# Altium schematic sheet 0093_M.2 KEY-E WLAN-BT.SchDoc
size A3
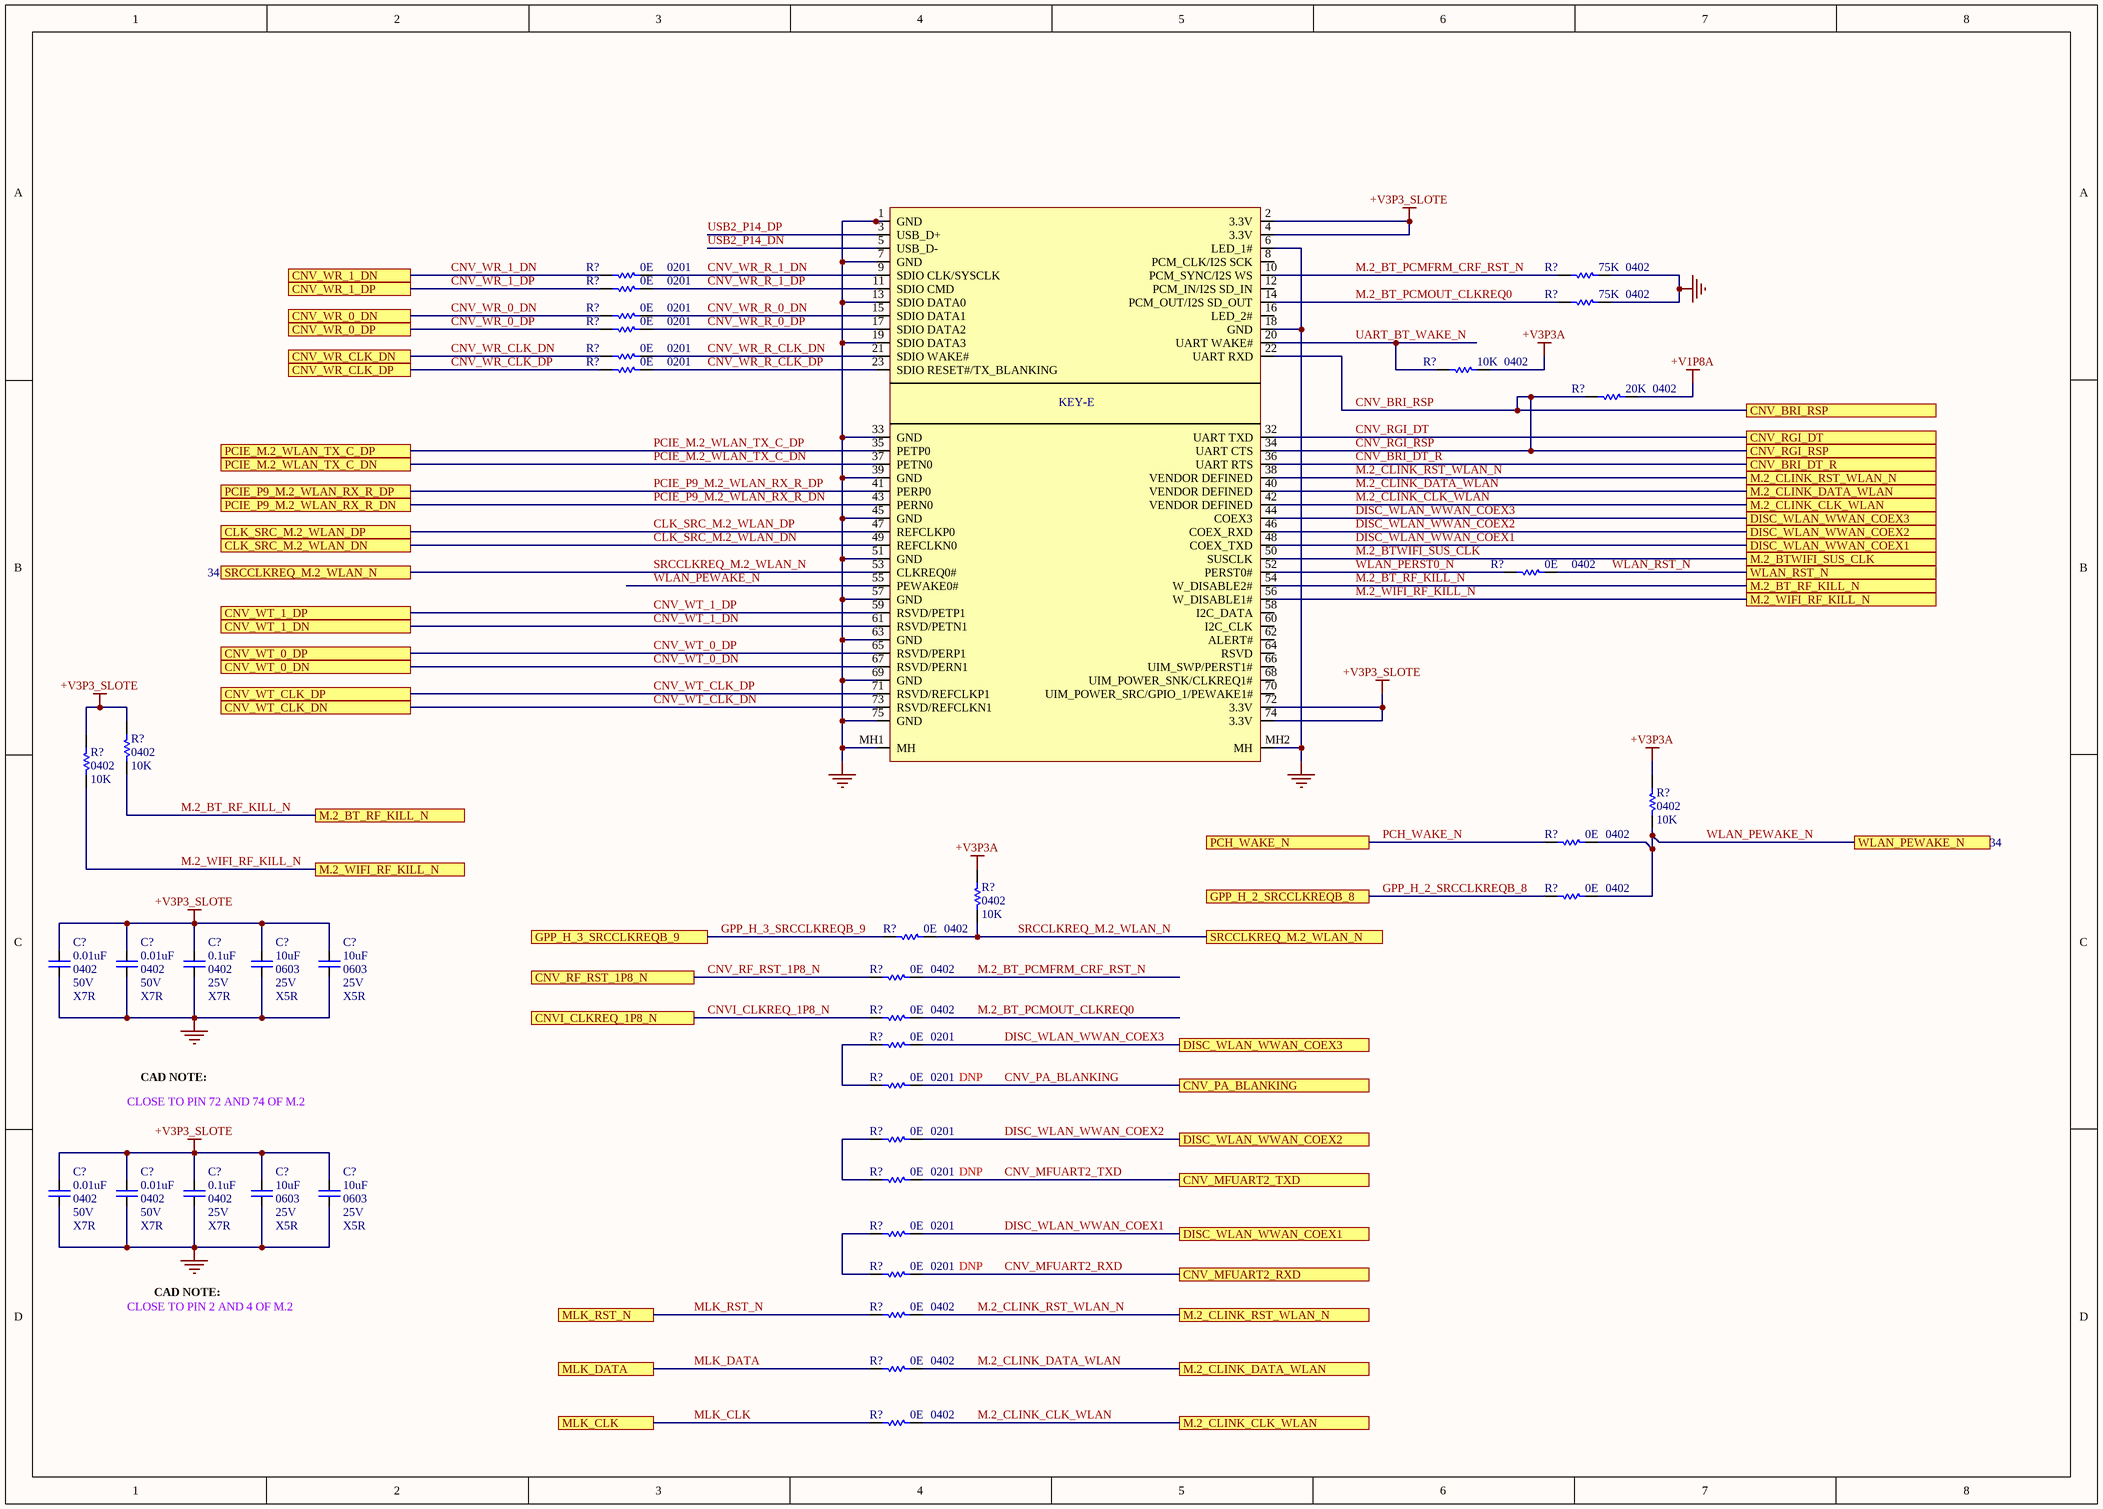
[diagram p0: 0093_M.2 KEY-E WLAN-BT.SchDoc]

## Parts
(Parts that share a designator on the sheet are numbered #1, #2 ... from top to bottom, then left to right.)
C?#1  value 0.01uF  Case/Package: 0402  Voltage: 50V  Dielectric: X7R  [CAPC0402]
C?#2  value 0.01uF  Case/Package: 0402  Voltage: 50V  Dielectric: X7R  [CAPC0402]
C?#3  value 0.1uF  Case/Package: 0402  Voltage: 25V  Dielectric: X7R  [CAPC0402]
C?#4  value 10uF  Case/Package: 0603  Voltage: 25V  Dielectric: X5R  [RESC0603]
C?#5  value 10uF  Case/Package: 0603  Voltage: 25V  Dielectric: X5R  [RESC0603]
C?#6  value 0.01uF  Case/Package: 0402  Voltage: 50V  Dielectric: X7R  [CAPC0402]
C?#7  value 0.01uF  Case/Package: 0402  Voltage: 50V  Dielectric: X7R  [CAPC0402]
C?#8  value 0.1uF  Case/Package: 0402  Voltage: 25V  Dielectric: X7R  [CAPC0402]
C?#9  value 10uF  Case/Package: 0603  Voltage: 25V  Dielectric: X5R  [RESC0603]
C?#10  value 10uF  Case/Package: 0603  Voltage: 25V  Dielectric: X5R  [RESC0603]
J?  C_M2_75P_KEYE_2EM  (value not drawn)
R?#1  value 0E  Case/Package: 0201  [RESC0201]  (hidden comment: Res)
R?#2  value 75K  Case/Package: 0402  [RESC0402]  (hidden comment: Res)
R?#3  value 0E  Case/Package: 0201  [RESC0201]  (hidden comment: Res)
R?#4  value 75K  Case/Package: 0402  [RESC0402]  (hidden comment: Res)
R?#5  value 0E  Case/Package: 0201  [RESC0201]  (hidden comment: Res)
R?#6  value 0E  Case/Package: 0201  [RESC0201]  (hidden comment: Res)
R?#7  value 0E  Case/Package: 0201  [RESC0201]  (hidden comment: Res)
R?#8  value 0E  Case/Package: 0201  [RESC0201]  (hidden comment: Res)
R?#9  value 10K  Case/Package: 0402  [RESC0402]  (hidden comment: Res)
R?#10  value 20K  Case/Package: 0402  [RESC0402]  (hidden comment: Res)
R?#11  value 0E  Case/Package: 0402  [RESC0402]  (hidden comment: Res)
R?#12  value 10K  Case/Package: 0402  [RESC0402]  (hidden comment: Res)
R?#13  value 10K  Case/Package: 0402  [RESC0402]  (hidden comment: Res)
R?#14  value 10K  Case/Package: 0402  [RESC0402]  (hidden comment: Res)
R?#15  value 0E  Case/Package: 0402  [RESC0402]  (hidden comment: Res)
R?#16  value 10K  Case/Package: 0402  [RESC0402]  (hidden comment: Res)
R?#17  value 0E  Case/Package: 0402  [RESC0402]  (hidden comment: Res)
R?#18  value 0E  Case/Package: 0402  [RESC0402]  (hidden comment: Res)
R?#19  value 0E  Case/Package: 0402  [RESC0402]  (hidden comment: Res)
R?#20  value 0E  Case/Package: 0402  [RESC0402]  (hidden comment: Res)
R?#21  value 0E  Case/Package: 0201  [RESC0201]  (hidden comment: Res)
R?#22  value 0E  Case/Package: 0201  [RESC0201]  (hidden comment: Res)
R?#23  value 0E  Case/Package: 0201  [RESC0201]  (hidden comment: Res)
R?#24  value 0E  Case/Package: 0201  [RESC0201]  (hidden comment: Res)
R?#25  value 0E  Case/Package: 0201  [RESC0201]  (hidden comment: Res)
R?#26  value 0E  Case/Package: 0201  [RESC0201]  (hidden comment: Res)
R?#27  value 0E  Case/Package: 0402  [RESC0402]  (hidden comment: Res)
R?#28  value 0E  Case/Package: 0402  [RESC0402]  (hidden comment: Res)
R?#29  value 0E  Case/Package: 0402  [RESC0402]  (hidden comment: Res)

## Ports
CLK_SRC_M.2_WLAN_DN, CLK_SRC_M.2_WLAN_DP, CNV_BRI_DT_R, CNV_BRI_RSP, CNV_MFUART2_RXD, CNV_MFUART2_TXD, CNV_PA_BLANKING, CNV_RF_RST_1P8_N, CNV_RGI_DT, CNV_RGI_RSP, CNV_WR_0_DN, CNV_WR_0_DP, CNV_WR_1_DN, CNV_WR_1_DP, CNV_WR_CLK_DN, CNV_WR_CLK_DP, CNV_WT_0_DN, CNV_WT_0_DP, CNV_WT_1_DN, CNV_WT_1_DP, CNV_WT_CLK_DN, CNV_WT_CLK_DP, CNVI_CLKREQ_1P8_N, DISC_WLAN_WWAN_COEX1, DISC_WLAN_WWAN_COEX2, DISC_WLAN_WWAN_COEX3, GPP_H_2_SRCCLKREQB_8, GPP_H_3_SRCCLKREQB_9, M.2_BT_RF_KILL_N, M.2_BTWIFI_SUS_CLK, M.2_CLINK_CLK_WLAN, M.2_CLINK_DATA_WLAN, M.2_CLINK_RST_WLAN_N, M.2_WIFI_RF_KILL_N, MLK_CLK, MLK_DATA, MLK_RST_N, PCH_WAKE_N, PCIE_M.2_WLAN_TX_C_DN, PCIE_M.2_WLAN_TX_C_DP, PCIE_P9_M.2_WLAN_RX_R_DN, PCIE_P9_M.2_WLAN_RX_R_DP, SRCCLKREQ_M.2_WLAN_N, WLAN_PEWAKE_N, WLAN_RST_N

## Nets
3P3V_2: J?.2(3P3V_2)
3P3V_4: J?.4(3P3V_4)
3P3V_72: J?.72(3P3V_72)
3P3V_74: J?.74(3P3V_74)
+V1P8A: R?#10.2
+V3P3_SLOTE: C?#1.2 C?#2.2 C?#3.2 C?#4.2 C?#5.2 C?#6.2 C?#7.2 C?#8.2 C?#9.2 C?#10.2 J?.2(3.3V) J?.4(3.3V) J?.72(3.3V) J?.74(3.3V) R?#12.2 R?#13.2
+V3P3A: R?#9.2 R?#14.2 R?#16.2
GND: C?#1.1 C?#2.1 C?#3.1 C?#4.1 C?#5.1 C?#6.1 C?#7.1 C?#8.1 C?#9.1 C?#10.1 J?.1(GND) J?.6(LED_1#) J?.7(GND) J?.13(SDIO_DATA0) J?.18(GND) J?.19(SDIO_DATA3) J?.33(GND) J?.39(GND) J?.45(GND) J?.51(GND) J?.57(GND) J?.63(GND) J?.69(GND) J?.75(GND) J?.MH1(MH) J?.MH2(MH) R?#2.2 R?#4.2
CLK_SRC_M.2_WLAN_DN: J?.49(REFCLKN0) ; port CLK_SRC_M.2_WLAN_DN
CLK_SRC_M.2_WLAN_DP: J?.47(REFCLKP0) ; port CLK_SRC_M.2_WLAN_DP
CNV_BRI_DT_R: J?.36(UART_RTS) ; port CNV_BRI_DT_R
CNV_BRI_RSP: J?.22(UART_RXD) J?.34(UART_CTS) R?#10.1 ; port CNV_BRI_RSP, port CNV_RGI_RSP  [also labelled CNV_RGI_RSP]
CNV_MFUART2_RXD: R?#26.1 ; port CNV_MFUART2_RXD
CNV_MFUART2_TXD: R?#24.1 ; port CNV_MFUART2_TXD
CNV_PA_BLANKING: R?#22.1 ; port CNV_PA_BLANKING
CNV_RF_RST_1P8_N: R?#19.2 ; port CNV_RF_RST_1P8_N
CNV_RGI_DT: J?.32(UART_TXD) ; port CNV_RGI_DT
CNV_WR_0_DN: R?#5.1 ; port CNV_WR_0_DN
CNV_WR_0_DP: R?#6.1 ; port CNV_WR_0_DP
CNV_WR_1_DN: R?#1.1 ; port CNV_WR_1_DN
CNV_WR_1_DP: R?#3.1 ; port CNV_WR_1_DP
CNV_WR_CLK_DN: R?#7.1 ; port CNV_WR_CLK_DN
CNV_WR_CLK_DP: R?#8.1 ; port CNV_WR_CLK_DP
CNV_WR_R_0_DN: J?.15(SDIO_DATA1) R?#5.2
CNV_WR_R_0_DP: J?.17(SDIO_DATA2) R?#6.2
CNV_WR_R_1_DN: J?.9(SDIO_CLK/SYSCLK) R?#1.2
CNV_WR_R_1_DP: J?.11(SDIO_CMD) R?#3.2
CNV_WR_R_CLK_DN: J?.21(SDIO_WAKE#) R?#7.2
CNV_WR_R_CLK_DP: J?.23(SDIO_RESET#/TX_BLANKING) R?#8.2
CNV_WT_0_DN: J?.67(RSVD/PERN1) ; port CNV_WT_0_DN
CNV_WT_0_DP: J?.65(RSVD/PERP1) ; port CNV_WT_0_DP
CNV_WT_1_DN: J?.61(RSVD/PETN1) ; port CNV_WT_1_DN
CNV_WT_1_DP: J?.59(RSVD/PETP1) ; port CNV_WT_1_DP
CNV_WT_CLK_DN: J?.73(RSVD/REFCLKN1) ; port CNV_WT_CLK_DN
CNV_WT_CLK_DP: J?.71(RSVD/REFCLKP1) ; port CNV_WT_CLK_DP
CNVI_CLKREQ_1P8_N: R?#20.2 ; port CNVI_CLKREQ_1P8_N
DISC_WLAN_WWAN_COEX1: J?.48(COEX_TXD) R?#25.1 ; port DISC_WLAN_WWAN_COEX1
DISC_WLAN_WWAN_COEX2: J?.46(COEX_RXD) R?#23.1 ; port DISC_WLAN_WWAN_COEX2
DISC_WLAN_WWAN_COEX3: J?.44(COEX3) R?#21.1 ; port DISC_WLAN_WWAN_COEX3
GPP_H_2_SRCCLKREQB_8: R?#17.2 ; port GPP_H_2_SRCCLKREQB_8
GPP_H_3_SRCCLKREQB_9: R?#18.2 ; port GPP_H_3_SRCCLKREQB_9
M.2_BT_PCMFRM_CRF_RST_N: J?.10(PCM_SYNC/I2S_WS) R?#2.1 R?#19.1
M.2_BT_PCMOUT_CLKREQ0: J?.14(PCM_OUT/I2S_SD_OUT) R?#4.1 R?#20.1
M.2_BT_RF_KILL_N: J?.54(W_DISABLE2#) R?#12.1 ; port M.2_BT_RF_KILL_N
M.2_BTWIFI_SUS_CLK: J?.50(SUSCLK) ; port M.2_BTWIFI_SUS_CLK
M.2_CLINK_CLK_WLAN: J?.42(VENDOR_DEFINED) R?#29.1 ; port M.2_CLINK_CLK_WLAN
M.2_CLINK_DATA_WLAN: J?.40(VENDOR_DEFINED) R?#28.1 ; port M.2_CLINK_DATA_WLAN
M.2_CLINK_RST_WLAN_N: J?.38(VENDOR_DEFINED) R?#27.1 ; port M.2_CLINK_RST_WLAN_N
M.2_WIFI_RF_KILL_N: J?.56(W_DISABLE1#) R?#13.1 ; port M.2_WIFI_RF_KILL_N
MLK_CLK: R?#29.2 ; port MLK_CLK
MLK_DATA: R?#28.2 ; port MLK_DATA
MLK_RST_N: R?#27.2 ; port MLK_RST_N
PCH_WAKE_N: R?#15.2 ; port PCH_WAKE_N
PCIE_M.2_WLAN_TX_C_DN: J?.37(PETN0) ; port PCIE_M.2_WLAN_TX_C_DN
PCIE_M.2_WLAN_TX_C_DP: J?.35(PETP0) ; port PCIE_M.2_WLAN_TX_C_DP
PCIE_P9_M.2_WLAN_RX_R_DN: J?.43(PERN0) ; port PCIE_P9_M.2_WLAN_RX_R_DN
PCIE_P9_M.2_WLAN_RX_R_DP: J?.41(PERP0) ; port PCIE_P9_M.2_WLAN_RX_R_DP
SRCCLKREQ_M.2_WLAN_N: J?.53(CLKREQ0#) R?#16.1 R?#18.1 ; port SRCCLKREQ_M.2_WLAN_N
UART_BT_WAKE_N: J?.20(UART_WAKE#) R?#9.1
USB2_P14_DN: J?.5(USB_D-)
USB2_P14_DP: J?.3(USB_D+)
WLAN_PERST0_N: J?.52(PERST0#) R?#11.1
WLAN_PEWAKE_N: J?.55(PEWAKE0#) R?#14.1 R?#15.1 R?#17.1 ; port WLAN_PEWAKE_N
WLAN_RST_N: R?#11.2 ; port WLAN_RST_N
NetR?#21_2: R?#21.2 R?#22.2
NetR?#23_2: R?#23.2 R?#24.2
NetR?#25_2: R?#25.2 R?#26.2

Not connected (* = marked no-connect by the designer): J? 8(PCM_CLK/I2S_SCK) 12(PCM_IN/I2S_SD_IN) 16(LED_2#) 58(I2C_DATA) 60(I2C_CLK) 62(ALERT#) 64(RSVD) 66(UIM_SWP/PERST1#) 68(UIM_POWER_SNK/CLKREQ1#) 70(UIM_POWER_SRC/GPIO_1/PEWAKE1#)

## Notes on the sheet
- CLOSE TO PIN 72 AND 74 OF M.2
- CAD NOTE:
- CLOSE TO PIN 2 AND 4 OF M.2
- (in symbol C_M2_75P_KEYE_2EM) KEY-E

## Library data of the parts
C?#1 C?#2 C?#6 C?#7 = Cap: CAP CER 0.01uF 50V X7R 0402
C?#3-C?#5 C?#8-C?#10 = Cap: CAP CER 0.1uF 50V X7R 0402
J? = C_M2_75P_KEYE_2EM: CDS_LMAN_SYM_OUTLINE: -700,2100,700,-2100; ROOM: NONE; OriginalSymbolOrigin: (-750,2100); FP_TECH: ?; IP: ?; PACK_TYPE: ?; VARIANT: ?
R?#1 R?#3 R?#5-R?#8 R?#21-R?#26 = Res: Thick Film Resistor -  0ohm, 1%, 0201
  R?#22 R?#24 R?#26: DNP: DNP
R?#2 R?#4 = Res: Thick Film Resistor -  75Kohm, 1%, 0402
R?#9 R?#12-R?#14 R?#16 = Res: Thick Film Resistor -  10Kohm, 1%, 0402
R?#10 = Res: Thick Film Resistor -  20Kohm, 1%, 0402
R?#11 R?#15 R?#17-R?#20 R?#27-R?#29 = Res: Thick Film Resistor -  0ohm, 1%, 0402